# EAGLE schematic Schematic (EAGLE 9.6.2)
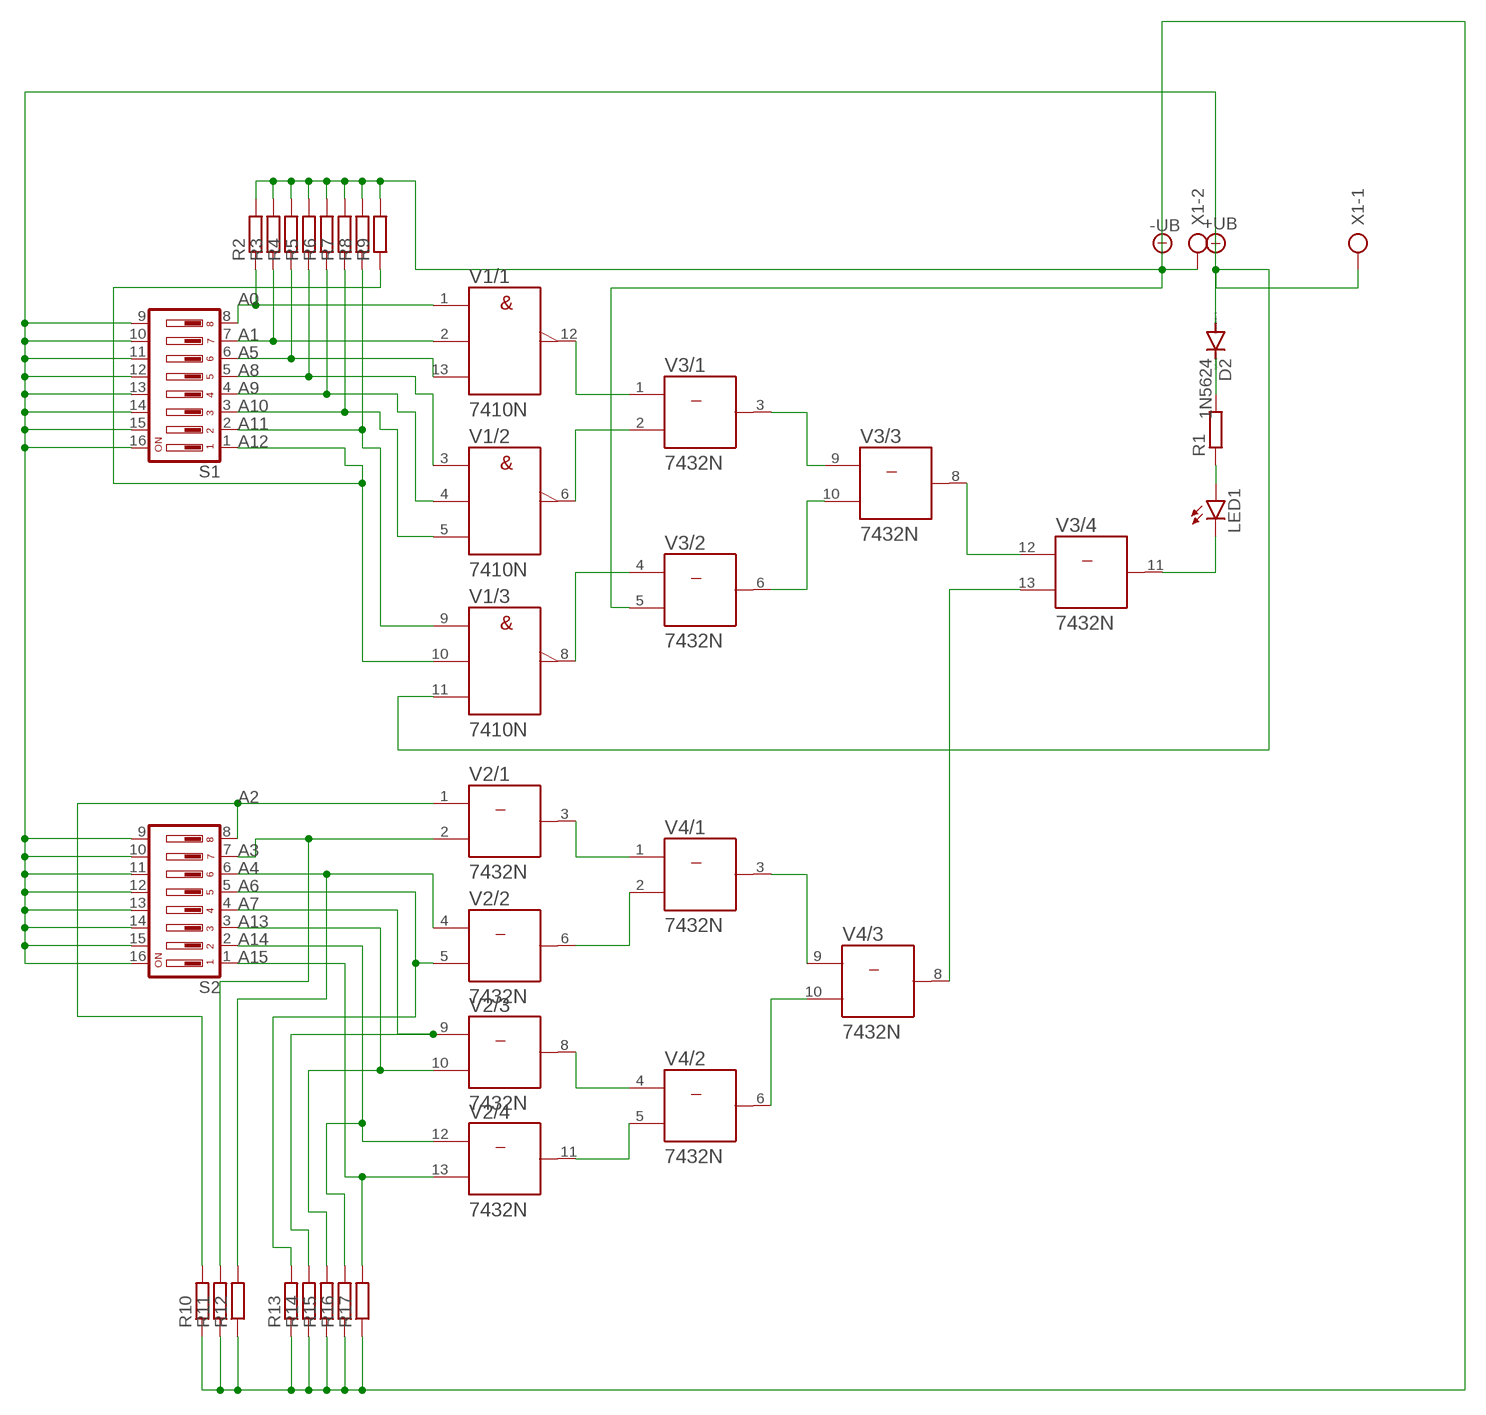
[diagram p0: schematic, sheet 1]

## Parts
D2  1N5624  [DO201-15]
LED1  LED5MM  [LED5MM]
R1  R-EU_0207/10  [0207/10]
R2  R-EU_0207/10  [0207/10]
R3  R-EU_0207/10  [0207/10]
R4  R-EU_0207/10  [0207/10]
R5  R-EU_0207/10  [0207/10]
R6  R-EU_0207/10  [0207/10]
R7  R-EU_0207/10  [0207/10]
R8  R-EU_0207/10  [0207/10]
R9  R-EU_0207/10  [0207/10]
R10  R-EU_0207/10  [0207/10]
R11  R-EU_0207/10  [0207/10]
R12  R-EU_0207/10  [0207/10]
R13  R-EU_0207/10  [0207/10]
R14  R-EU_0207/10  [0207/10]
R15  R-EU_0207/10  [0207/10]
R16  R-EU_0207/10  [0207/10]
R17  R-EU_0207/10  [0207/10]
S1  SD4-08  [SD4-08]
S2  SD4-08  [SD4-08]
V1  7410N  [DIL14]
V2  7432N  [DIL14]
V3  7432N  [DIL14]
V4  7432N  [DIL14]
X1  AK500/2  [AK500/2]

## Nets
+UB: D2.A S1.9 S1.10 S1.11 S1.12 S1.13 S1.14 S1.15 S1.16 S2.9 S2.10 S2.11 S2.12 S2.13 S2.14 S2.15 S2.16 V1.11(/3:C) X1.1
-UB: R2.2 R3.2 R4.2 R5.2 R6.2 R7.2 R8.2 R9.2 R10.1 R11.1 R12.1 R13.1 R14.1 R15.1 R16.1 R17.1 V3.5(/2:B) X1.2
A0: R2.1 S1.8 V1.1(/1:A)
A1: R3.1 S1.7 V1.2(/1:B)
A2: R10.2 S2.8 V2.1(/1:A)
A3: R11.2 S2.7 V2.2(/1:B)
A4: R12.2 S2.6 V2.4(/2:A)
A5: R4.1 S1.6 V1.13(/1:C)
A6: R13.2 S2.5 V2.5(/2:B)
A7: R14.2 S2.4 V2.9(/3:A)
A8: R5.1 S1.5 V1.3(/2:A)
A9: R6.1 S1.4 V1.4(/2:B)
A10: R7.1 S1.3 V1.5(/2:C)
A11: R8.1 S1.2 V1.9(/3:A)
A12: R9.1 S1.1 V1.10(/3:B)
A13: R15.2 S2.3 V2.10(/3:B)
A14: R16.2 S2.2 V2.12(/4:A)
A15: R17.2 S2.1 V2.13(/4:B)
N$1: LED1.K(C) V3.11(/4:Y)
N$2: LED1.A R1.1
N$3: D2.C R1.2
N$9: V2.3(/1:Y) V4.1(/1:A)
N$10: V2.6(/2:Y) V4.2(/1:B)
N$11: V2.8(/3:Y) V4.4(/2:A)
N$12: V2.11(/4:Y) V4.5(/2:B)
N$13: V4.3(/1:Y) V4.9(/3:A)
N$14: V4.6(/2:Y) V4.10(/3:B)
N$15: V1.12(/1:Y) V3.1(/1:A)
N$16: V1.6(/2:Y) V3.2(/1:B)
N$17: V1.8(/3:Y) V3.4(/2:A)
N$18: V3.3(/1:Y) V3.9(/3:A)
N$19: V3.6(/2:Y) V3.10(/3:B)
N$20: V3.8(/3:Y) V3.12(/4:A)
N$21: V3.13(/4:B) V4.8(/3:Y)
Unconnected: V4.11(/4:Y) V4.12(/4:A) V4.13(/4:B)

## Power pins joined to a net without a drawn wire
+UB: V1.14(/+UB:+UB) V2.14(/+UB:+UB) V3.14(/+UB:+UB) V4.14(/+UB:+UB)
-UB: V1.7(/-UB:-UB) V2.7(/-UB:-UB) V3.7(/-UB:-UB) V4.7(/-UB:-UB)

## Library data of the parts
D2 = diode:1N5624: DIODE controlled avalanche rectifier
LED1 = led:LED: LED OSRAM: - CHIPLED LG R971, LG N971, LY N971, LG Q971, LY Q971, LO R971, LY R971 LH N974, LH R974 LS Q976, LO Q976, LY Q976 LO Q996 - Hyper CHIPLED LW Q18S LB Q993, LB Q99A, LB R99A - SideLED LS A670, LO A670, LY A670, LG A670, LP A670 LB A673, LV A673, LT A673, LW A673 LH A674 LY A675 LS A676, LA A676, LO A676, LY A676, LW A676 LS A679, LY A679, LG A679 - Hyper Micro SIDELED® LS Y876, LA Y876, LO Y876, LY Y876 LT Y87S - SmartLED LW L88C, LW L88S LB L89C, LB L89S, LG L890 LS L89K, LO L89K, LY L89K LS L896, LA L896, LO L896, LY L896 - TOPLED LS T670, LO T670, LY T670, LG T670, LP T670 LSG T670, LSP T670, LSY T670, LOP T670, LYG T670 LG T671, LOG T671, LSG T671 LB T673, LV T673, LT T673, LW T673 LH T674 LS T676, LA T676, LO T676, LY T676, LB T676, LH T676, LSB T676, LW T676 LB T67C, LV T67C, LT T67C, LS T67K, LO T67K, LY T67K, LW E67C LS E67B, LA E67B, LO E67B, LY E67B, LB E67C, LV E67C, LT E67C LW T67C LS T679, LY T679, LG T679 LS T770, LO T770, LY T770, LG T770, LP T770 LB T773, LV T773, LT T773, LW T773 LH T774 LS E675, LA E675, LY E675, LS T675 LS T776, LA T776, LO T776, LY T776, LB T776 LHGB T686 LT T68C, LB T68C - Hyper Mini TOPLED® LB M676 - Mini TOPLED Santana® LG M470 LS M47K, LO M47K, LY M47K Source: http://www.osram.convergy.de LUXEON: - LUMILED® LXK2-PW12-R00, LXK2-PW12-S00, LXK2-PW14-U00, LXK2-PW14-V00 LXK2-PM12-R00, LXK2-PM12-S00, LXK2-PM14-U00 LXK2-PE12-Q00, LXK2-PE12-R00, LXK2-PE12-S00, LXK2-PE14-T00, LXK2-PE14-U00 LXK2-PB12-K00, LXK2-PB12-L00, LXK2-PB12-M00, LXK2-PB14-N00, LXK2-PB14-P00, LXK2-PB14-Q00 LXK2-PR12-L00, LXK2-PR12-M00, LXK2-PR14-Q00, LXK2-PR14-R00 LXK2-PD12-Q00, LXK2-PD12-R00, LXK2-PD12-S00 LXK2-PH12-R00, LXK2-PH12-S00 LXK2-PL12-P00, LXK2-PL12-Q00, LXK2-PL12-R00 Source: www.luxeon.com KINGBRIGHT: KA-3528ASYC Source: www.kingbright.com
R1-R17 = rcl:R-EU_: RESISTOR, European symbol; SPICEPREFIX: R
S1 S2 = switch-dil:SD4-08: DIL/CODE SWITCH; OC_FARNELL: unknown; OC_NEWARK: unknown
V1 = 74ttl-din:74*10: Triple 3-input NAND gate
V2-V4 = 74ttl-din:74*32: Quad 2-input OR gate
X1 = con-ptr500:AK500/2: CONNECTOR; OC_FARNELL: unknown; OC_NEWARK: unknown